# EAGLE design levelshifter (EAGLE 7.5.0)
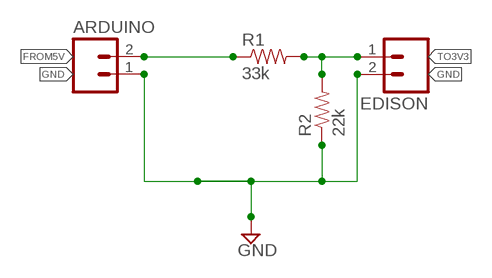
[diagram p0: schematic, sheet 1]

## Parts
ARDUINO  M02PTH3  [1X02_LONGPADS]
EDISON  M02PTH3  [1X02_LONGPADS]
R1  33k  RESISTORAXIAL-0.3  [AXIAL-0.3]
R2  22k  RESISTORAXIAL-0.3  [AXIAL-0.3]

## Nets
FROM5V: ARDUINO.2 R1.P$1
GND: ARDUINO.1 EDISON.2 R2.P$1
TO3V3: EDISON.1 R1.P$2 R2.P$2

## Library data of the parts
ARDUINO EDISON = SparkFun:M02: Header 2 Standard 2-pin 0.1" header. Use with straight break away headers (SKU : PRT-00116), right angle break away headers (PRT-00553), swiss pins (PRT-00743), machine pins (PRT-00117), and female headers (PRT-00115). Molex polarized connector foot print use with SKU : PRT-08233 with associated crimp pins and housings.
R1 R2 = SparkFun:RESISTOR: Resistor Basic schematic elements and footprints for 0603, 1206, and PTH resistors.

## Board
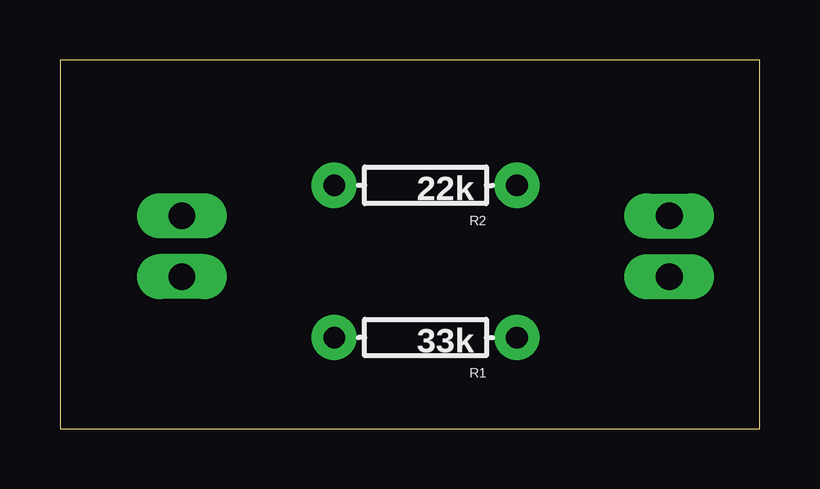
[diagram p1: board, top side]
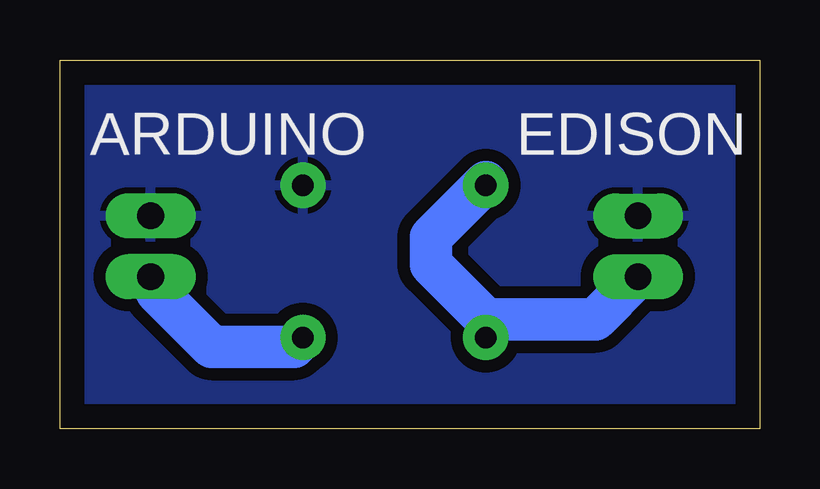
[diagram p2: board, bottom side, seen from below]

Size 29.18 x 15.39 mm. Coordinates in mm from the lower left corner, seen from the top.
Outline: 0,0 29.18,0 29.18,15.39 0,15.39 0,0
Copper layers (1*16): Top 0.035mm / dielectric 1.5mm / Bottom 0.035mm
Design rules "default *": minimum track width 70mil, minimum drill 24mil, track to track 20mil, track to pad 20mil, pad to pad 20mil, via to via 20mil, smd to smd 20mil, copper to edge 40mil, drill to drill 8mil, minimum pad ring 10mil, minimum via ring 8mil, stop-mask expansion 4mil, vias tented up to drill 0mil, thermal gap 10mil

### Footprints (pad centres in the part's own frame; a part is rotated, then mirrored left to right if it is on the bottom)
1X02_LONGPADS = drill 1.118 pad 1.88 long: 1 0,0; 2 2.54,0
AXIAL-0.3 = drill 0.9 pad 1.88: P$1 -3.81,0; P$2 3.81,0

### Placement (x,y rotation side)
ARDUINO  25.4,8.89 270 top
EDISON  5.08,6.35 90 top
R1  15.24,3.81 180 top
R2  15.24,10.16 180 top

### Tracks (layer width: path | path; a pad name or v marks a point on that pad's centre or on a via)
FROM5V
  Bottom 1.778: R1.P$1 19.43,3.43 22.86,3.43 25.15,5.71 ARDUINO.2
GND
  pour Bottom: 0,0 29.21,0 29.21,15.24 0,15.24
TO3V3
  Bottom 1.778: EDISON.1 6.86,4.57 11.43,4.57 | 11.43,4.57 13.72,6.86 13.72,8 11.43,10.29 R2.P$2 | 11.43,4.57 R1.P$2

### Text on the board
bPlace: EDISON | ARDUINO